# EAGLE schematic connectors (EAGLE 9.2.2)
Assembly variants: BASIC
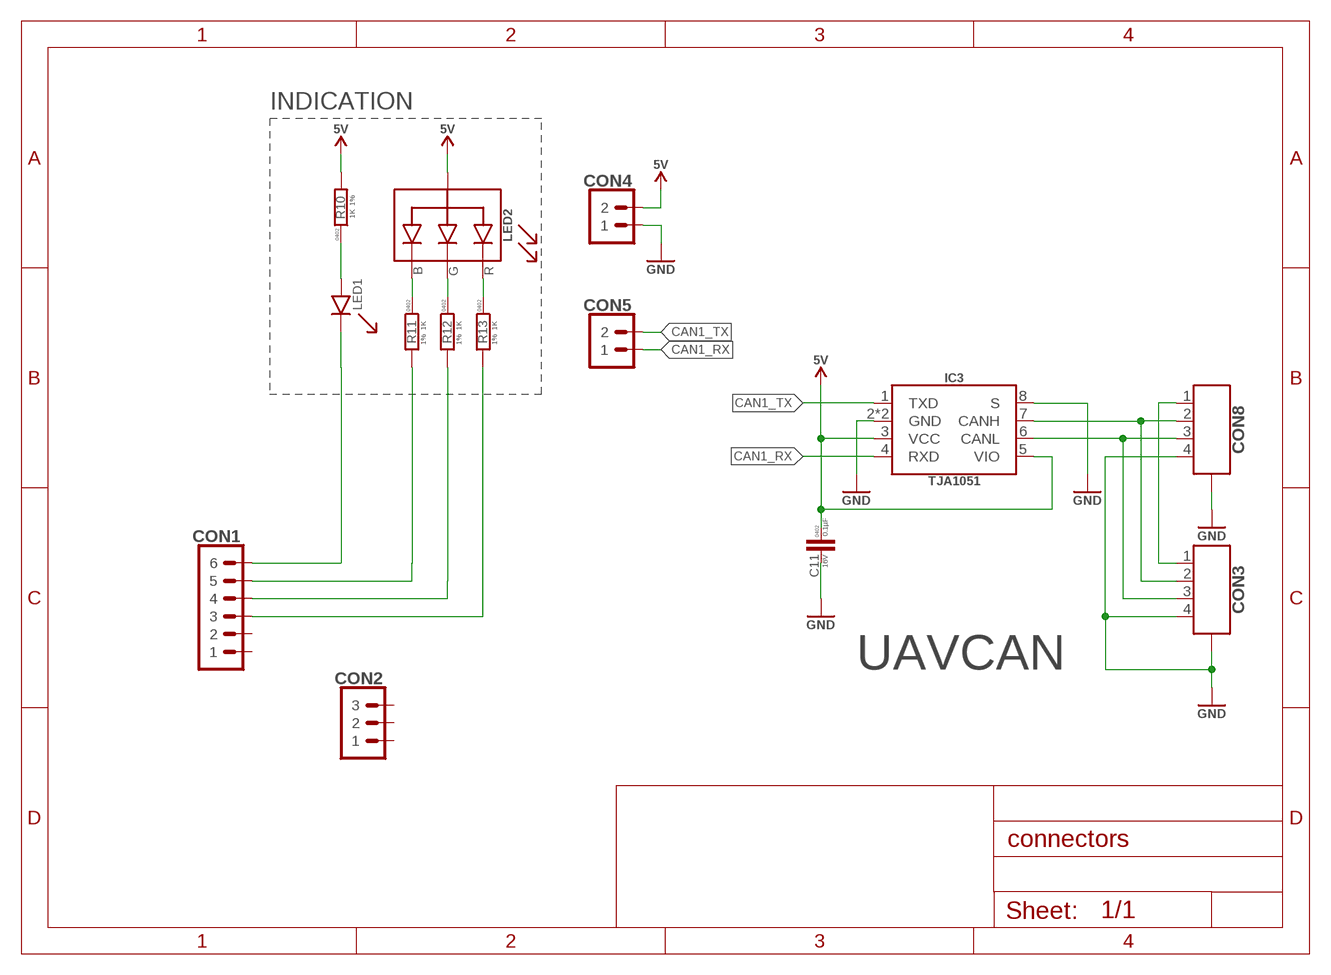
[diagram p0: schematic, sheet 1]

## Parts
C11  0.1µF  0.1µF-16V_10%_X7R-0402  [C0402]
CON1  PINHEAD_1X06-2  [1X06-PTH-2]
CON2  PINHEAD_1X03-2.54-RA  [1X03-PTH-2.54-RA]
CON3  CON-4P-JST_GH-RA  [JST_GH-4P-RA]
CON4  PINHEAD_1X02-2  [1X02-PTH-2]
CON5  PINHEAD_1X02-2  [1X02-PTH-2]
CON8  CON-4P-JST_GH-RA  [JST_GH-4P-RA]
IC3  TJA1051  [SOT782-1]
LED1  GREEN  LED-GREEN-0402  [0402_LED]
LED2  LTST-C19HE1WT  [LITE_ON_RGB_LED]
R10  1K  1K-1%-0402  [R0402]
R11  1K  1K-1%-0402  [R0402]
R12  1K  1K-1%-0402  [R0402]
R13  1K  1K-1%-0402  [R0402]

## Nets
CAN1_LED: CON1.6 LED1.C
CAN1_RX: CON5.1 IC3.4(RXD)
CAN1_TX: CON5.2 IC3.1(TXD)
GND: C11.2 CON3.4 CON3.M$0(GND) CON3.M$1(GND) CON4.1 CON8.4 CON8.M$0(GND) CON8.M$1(GND) IC3.2(GND) IC3.8(S) IC3.PAD(GND)
LED_GREEN: CON1.4 R12.2
LED_RED: CON1.3 R13.2
N$6: CON1.5 R11.2
N$7: LED1.A R10.1
N$23: CON3.2 CON8.2 IC3.7(CANH)
N$28: CON3.1 CON8.1
N$35: CON3.3 CON8.3 IC3.6(CANL)
N$58: LED2.R R13.1
N$59: LED2.G R12.1
N$60: LED2.B R11.1
VDD_5V: C11.1 CON4.2 IC3.3(VCC) IC3.5(VIO) LED2.+(A) R10.2 ; supply symbol labelled 5V
Unconnected: CON1.1 CON1.2 CON2.1 CON2.2 CON2.3

## Notes on the sheet
- INDICATION
- UAVCAN

## Library data of the parts
C11 = C_digikey:0.1µF; DIGIKEY#: 490-3261-1-ND; MANF: Murata Electronics North America; MANF#: GRM155R71C104KA88D; OPERATING_TEMP: -55°C ~ 125°C; PACKAGE: 0402; TC: X7R; TOLERANCE: +-10%; VOLTAGE: 16V
CON1 = pinhead:PINHEAD_1X06: pinheader 6P
CON2 = pinhead:PINHEAD_1X03: pinheader 3P
CON3 CON8 = Connectors:CON-4P: Connector Receptacle 4 Position 0.049" (1.25mm) Tin Surface Mount; DIGIKEY#: 455-1566-1-ND; MANF: JST Sales America Inc; MANF#: SM04B-GHS-TB(LF)(SN)
CON4 CON5 = pinhead:PINHEAD_1X02: pinheader 2P
IC3 = myxa_masterlib:TJA1051: 1/1 Transceiver Half CAN 8-HVSON (3x3); DIGIKEY#: 568-8686-2-ND; MANF: NXP Semiconductors; MANF#: TJA1051TK/3,118
LED1 = myxa_masterlib:LED; COLOR: GREEN; DIGIKEY#: 511-1652-1-ND; MANF: Rohm Semiconductor; MANF#: SML-P11MTT86
LED2 = myxa_masterlib:LTST-C19HE1WT; DIGIKEY#: 160-2162-1-ND; MANF: Lite-On Inc; MANF#: LTST-C19HE1WT
R10-R13 = R_digikey:1K; DIGIKEY#: 311-1.00KLRCT-ND; MANF: Yageo; MANF#: RC0402FR-071KL; PACKAGE: 0402; TOLERANCE: 1%

## Net classes
1 HV: clearance 0.25 mm to class 0, clearance 0.25 mm